# EAGLE design board (EAGLE 7.5.0)
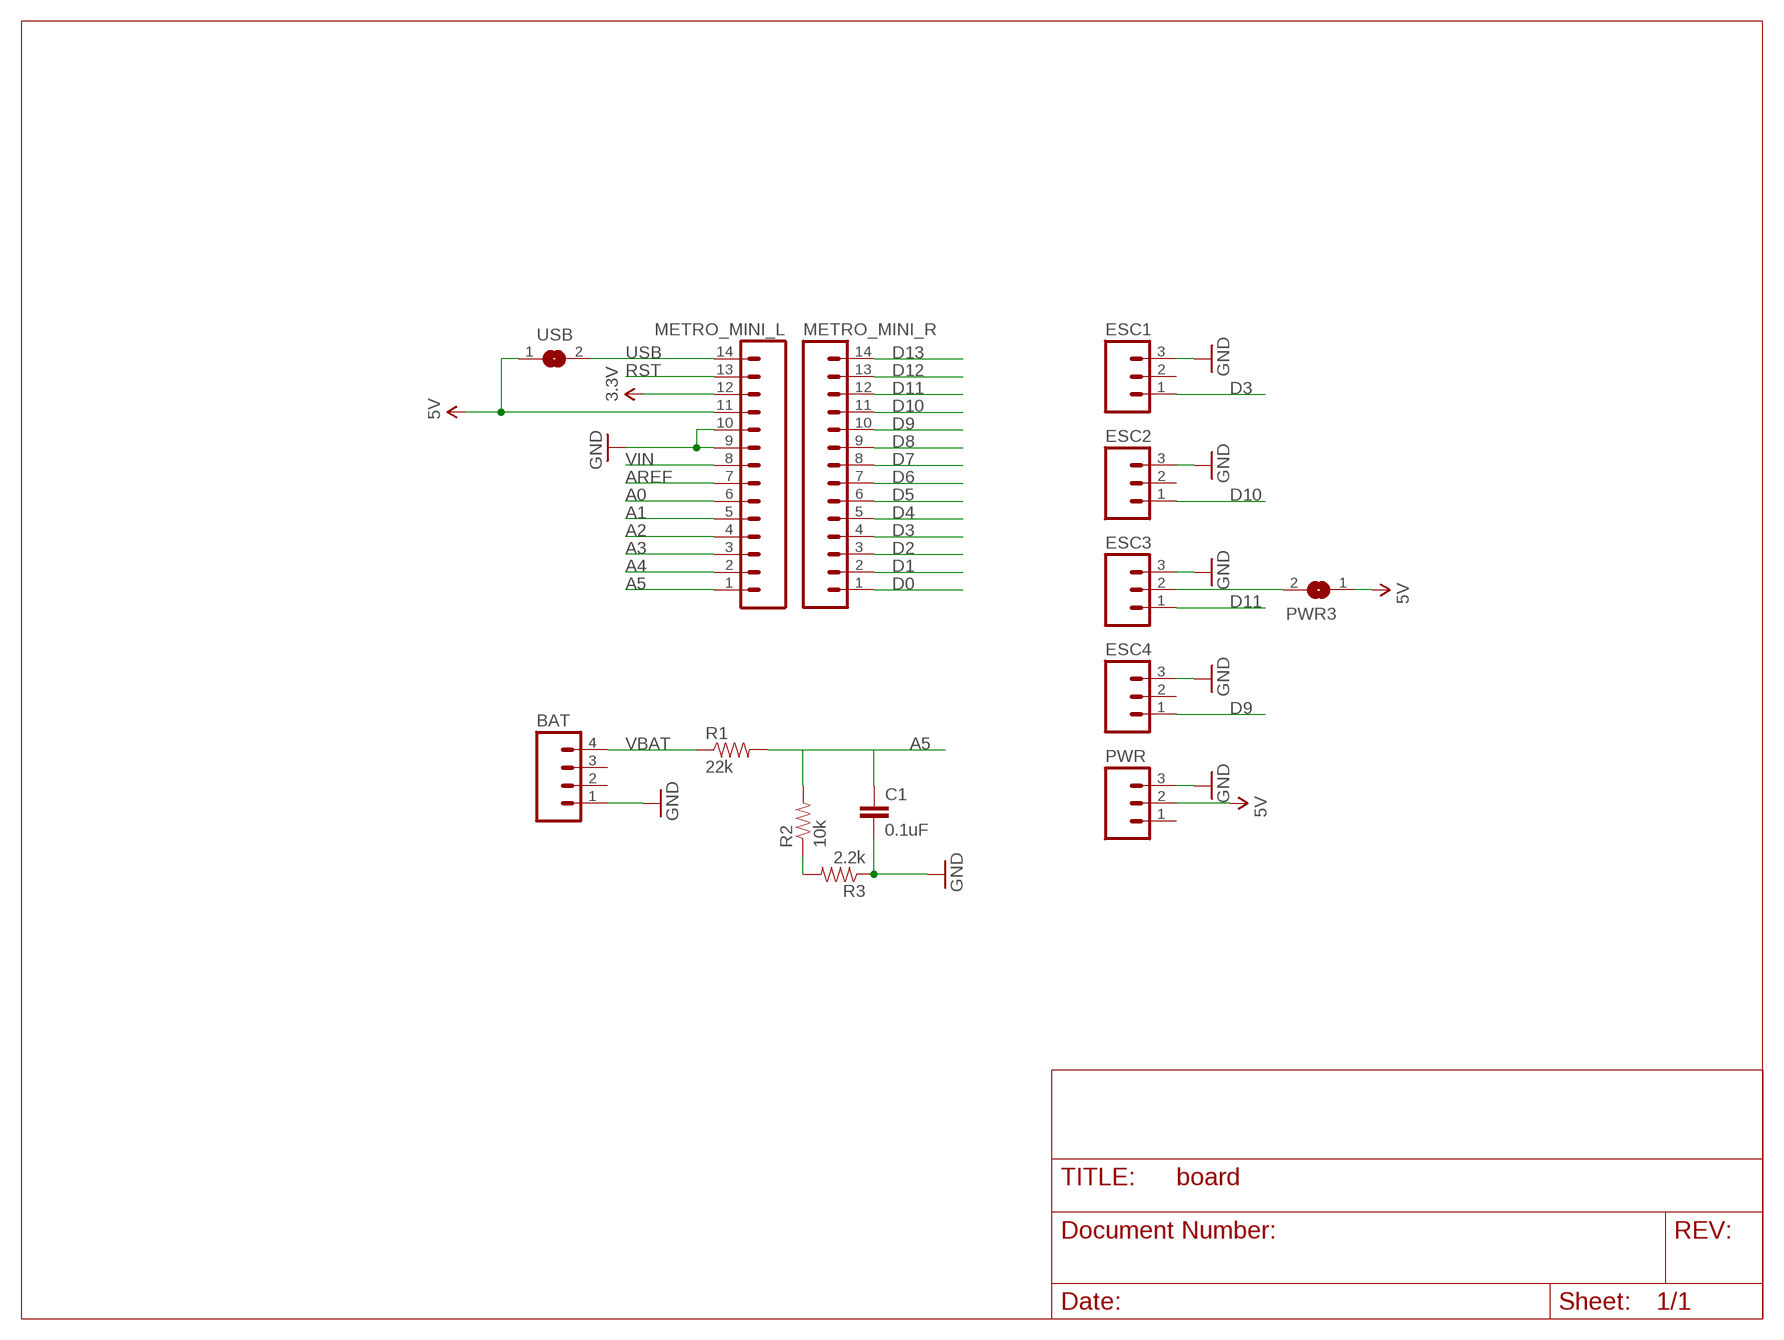
[diagram p0: schematic, sheet 1]

## Parts
BAT  M04POLAR  [MOLEX-1X4]
C1  0.1uF  CAP_  [AXIAL-5MM]
ESC1  M03POLAR  [MOLEX-1X3]
ESC2  M03POLAR  [MOLEX-1X3]
ESC3  M03POLAR  [MOLEX-1X3]
ESC4  M03POLAR  [MOLEX-1X3]
METRO_MINI_L  M14  [1X14]
METRO_MINI_R  M14  [1X14]
PWR  M03POLAR  [MOLEX-1X3]
PWR3  SJW  [SJW]
R1  22k  RESISTORPTH-1/4W  [AXIAL-0.4]
R2  10k  RESISTORPTH-1/4W  [AXIAL-0.4]
R3  2.2k  RESISTORPTH-1/4W  [AXIAL-0.4]
USB  SJW  [SJW]

## Nets
3.3V: METRO_MINI_L.12
5V: METRO_MINI_L.11 PWR3.1 PWR.2 USB.1
A0: METRO_MINI_L.6
A1: METRO_MINI_L.5
A2: METRO_MINI_L.4
A3: METRO_MINI_L.3
A4: METRO_MINI_L.2
A5: C1.P$1 METRO_MINI_L.1 R1.P$2 R2.P$2
AREF [aref]: METRO_MINI_L.7
D0: METRO_MINI_R.1
D1: METRO_MINI_R.2
D2: METRO_MINI_R.3
D3: ESC1.1 METRO_MINI_R.4
D4: METRO_MINI_R.5
D5: METRO_MINI_R.6
D6: METRO_MINI_R.7
D7: METRO_MINI_R.8
D8: METRO_MINI_R.9
D9: ESC4.1 METRO_MINI_R.10
D10: ESC2.1 METRO_MINI_R.11
D11: ESC3.1 METRO_MINI_R.12
D12: METRO_MINI_R.13
D13: METRO_MINI_R.14
GND: BAT.1 C1.P$2 ESC1.3 ESC2.3 ESC3.3 ESC4.3 METRO_MINI_L.9 METRO_MINI_L.10 PWR.3 R3.P$1
N$1: R2.P$1 R3.P$2
N$2: ESC3.2 PWR3.2
RST: METRO_MINI_L.13
USB: METRO_MINI_L.14 USB.2
VBAT: BAT.4 R1.P$1
VIN: METRO_MINI_L.8
Unconnected: BAT.2 BAT.3 ESC1.2 ESC2.2 ESC4.2 PWR.1

## Library data of the parts
BAT = SparkFun-Connectors:M04: Header 4 Standard 4-pin 0.1" header. Use with straight break away headers (SKU : PRT-00116), right angle break away headers (PRT-00553), swiss pins (PRT-00743), machine pins (PRT-00117), and female headers (PRT-00115). Molex polarized connector foot print use with SKU : PRT-08231 with associated crimp pins and housings. 1MM SMD Version SKU: PRT-10208
C1 = SparkFun-Capacitors:CAP: Capacitor Standard 0603 ceramic capacitor, and 0.1" leaded capacitor.
ESC1-ESC4 PWR = SparkFun-Connectors:M03: Header 3 Standard 3-pin 0.1" header. Use with straight break away headers (SKU : PRT-00116), right angle break away headers (PRT-00553), swiss pins (PRT-00743), machine pins (PRT-00117), and female headers (PRT-00115). Molex polarized connector foot print use with SKU : PRT-08232 with associated crimp pins and housings.
METRO_MINI_L METRO_MINI_R = SparkFun-Connectors:M14: Header 14 Standard 14-pin 0.1" header. Use with straight break away headers (SKU : PRT-00116), right angle break away headers (PRT-00553), swiss pins (PRT-00743), machine pins (PRT-00117), and female headers (PRT-00115).
PWR3 USB = jumper:SJ: SMD solder JUMPER
R1-R3 = SparkFun-Passives:RESISTOR: Resistor Basic schematic elements and footprints for 0603, 1206, and PTH resistors.

## Net classes
1 power: width 0.305 mm, drill 0.483 mm, clearance 0.203 mm
2 gnd: width 0.305 mm, drill 0.483 mm, clearance 0.203 mm
3 usbvcc: width 0.305 mm, drill 0.483 mm, clearance 0.203 mm
4 aref: width 0.254 mm, drill 0.483 mm, clearance 0.203 mm

## Board
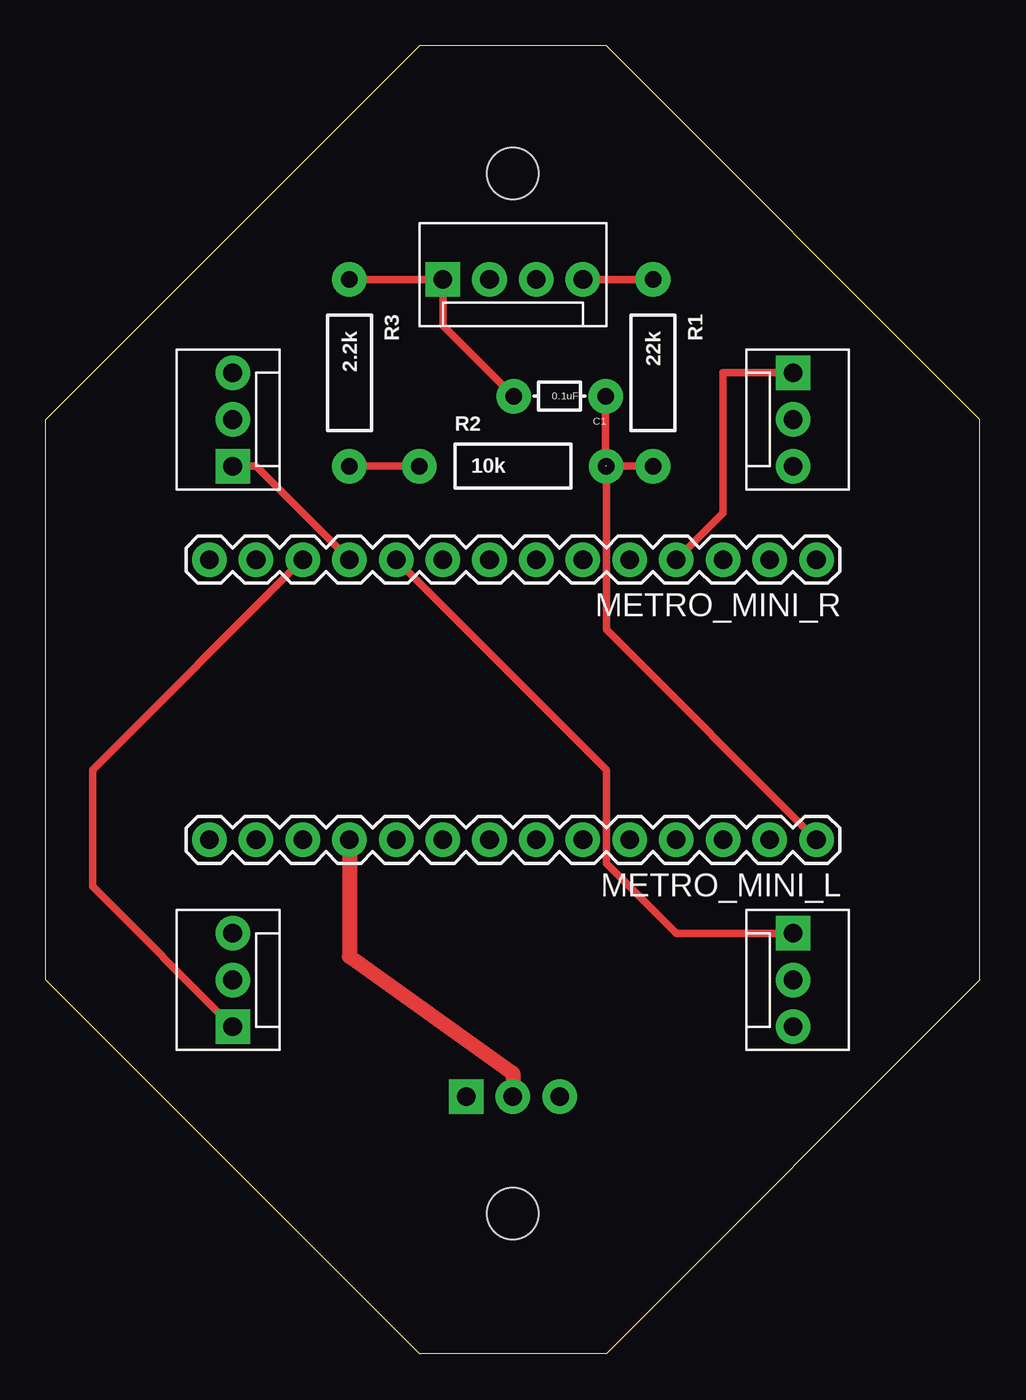
[diagram p1: board, top side]
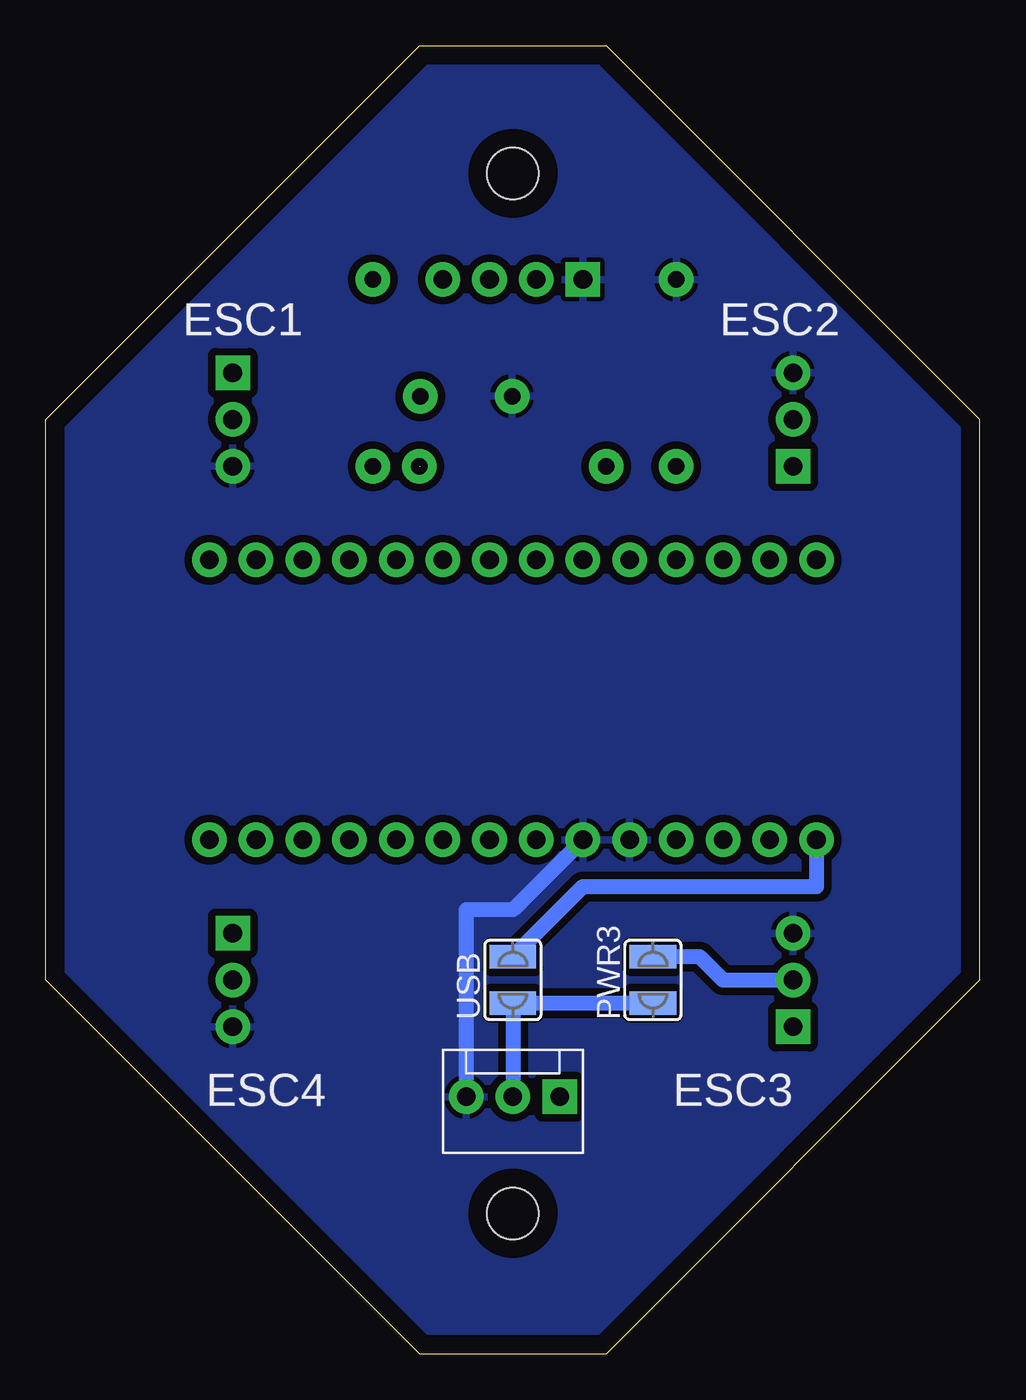
[diagram p2: board, bottom side, seen from below]

Size 50.8 x 71.12 mm. Coordinates in mm from the lower left corner, seen from the top.
Outline: 0,20.32 0,50.8 20.32,71.12 30.48,71.12 50.8,50.8 50.8,20.32 30.48,0 20.32,0 0,20.32
Copper layers (1*16): Top 0.035mm / dielectric 1.5mm / Bottom 0.035mm
Design rules "default": minimum track width 10mil, minimum drill 24mil, track to track 8mil, track to pad 8mil, pad to pad 8mil, via to via 8mil, smd to smd 8mil, copper to edge 40mil, drill to drill 8mil, minimum pad ring 10mil, minimum via ring 8mil, stop-mask expansion 4mil, vias tented up to drill 0mil, thermal gap 10mil
Holes 2.8 mm at 25.4,7.62 25.4,64.19

### Footprints (pad centres in the part's own frame; a part is rotated, then mirrored left to right if it is on the bottom)
MOLEX-1X4 = drill 1.016 pad 1.88 square: 1 0,0 | drill 1.016 pad 1.88: 2 2.54,0; 3 5.08,0; 4 7.62,0
AXIAL-5MM = drill 0.9 pad 1.88: P$1 -2.5,0; P$2 2.5,0
MOLEX-1X3 = drill 1.016 pad 1.88 square: 1 0,0 | drill 1.016 pad 1.88: 2 2.54,0; 3 5.08,0
1X14 = drill 1.016 pad 1.88: 1 0,0; 2 2.54,0; 3 5.08,0; 4 7.62,0; 5 10.16,0; 6 12.7,0; 7 15.24,0; 8 17.78,0; 9 20.32,0; 10 22.86,0; 11 25.4,0; 12 27.94,0; 13 30.48,0; 14 33.02,0
SJW = smd 1.27 x 2.54: 1 -1.27,0; 2 1.27,0
AXIAL-0.4 = drill 0.9 pad 1.88: P$1 -5.08,0; P$2 5.08,0

### Placement (x,y rotation side)
BAT  21.59,58.42 0 top
C1  27.94,52.07 180 top
ESC1  40.64,53.34 270 top
ESC2  10.16,48.26 90 top
ESC3  10.16,17.78 90 top
ESC4  40.64,22.86 270 top
METRO_MINI_L  41.91,27.94 180 top
METRO_MINI_R  41.91,43.18 180 top
PWR  22.86,13.97 180 bottom
PWR3  17.78,20.32 90 bottom
R1  33.02,53.34 270 top
R2  25.4,48.26 0 top
R3  16.51,53.34 270 top
USB  25.4,20.32 90 bottom

### Tracks (layer width: path | path; a pad name or v marks a point on that pad's centre or on a via)
5V
  Top 0.813: METRO_MINI_L.11 16.51,21.59 25.4,15.24 PWR.2
  Bottom 0.813: PWR.2 USB.1 PWR3.1
A5  (1 unrouted)
  Top 0.406: 30.44,48.26 C1.P$1 | R1.P$2 R2.P$2 30.48,39.37 METRO_MINI_L.1
D3
  Top 0.406: ESC1.1 36.83,53.34 36.83,45.72 METRO_MINI_R.4
D9
  Top 0.406: ESC4.1 34.29,22.86 30.48,26.67 30.48,31.75 METRO_MINI_R.10
D10
  Top 0.406: ESC2.1 11.43,48.26 METRO_MINI_R.11
D11
  Top 0.406: ESC3.1 2.54,25.4 2.54,31.75 METRO_MINI_R.12
GND
  Top 0.406: R3.P$1 BAT.1 21.59,55.92 C1.P$2
  Bottom 0.813: METRO_MINI_L.9 25.4,24.13 27.94,24.13 PWR.3
  pour Bottom (isolate 0.406): 20.32,71.12 30.48,71.12 50.8,50.8 50.8,20.32 30.48,0 20.32,0 0,20.32 0,50.8
N$1
  Top 0.406: R2.P$1 R3.P$2
N$2
  Bottom 0.813: PWR3.2 15.24,21.59 13.97,20.32 ESC3.2
USB
  Bottom 0.813: METRO_MINI_L.14 8.89,25.4 21.59,25.4 USB.2
VBAT
  Top 0.406: R1.P$1 BAT.4

### Text on the board
bPlace: ESC2 | ESC1 | ESC3 | ESC4